# EAGLE design SN74HC165 Shift-In Breakout-v11 (EAGLE 6.2)
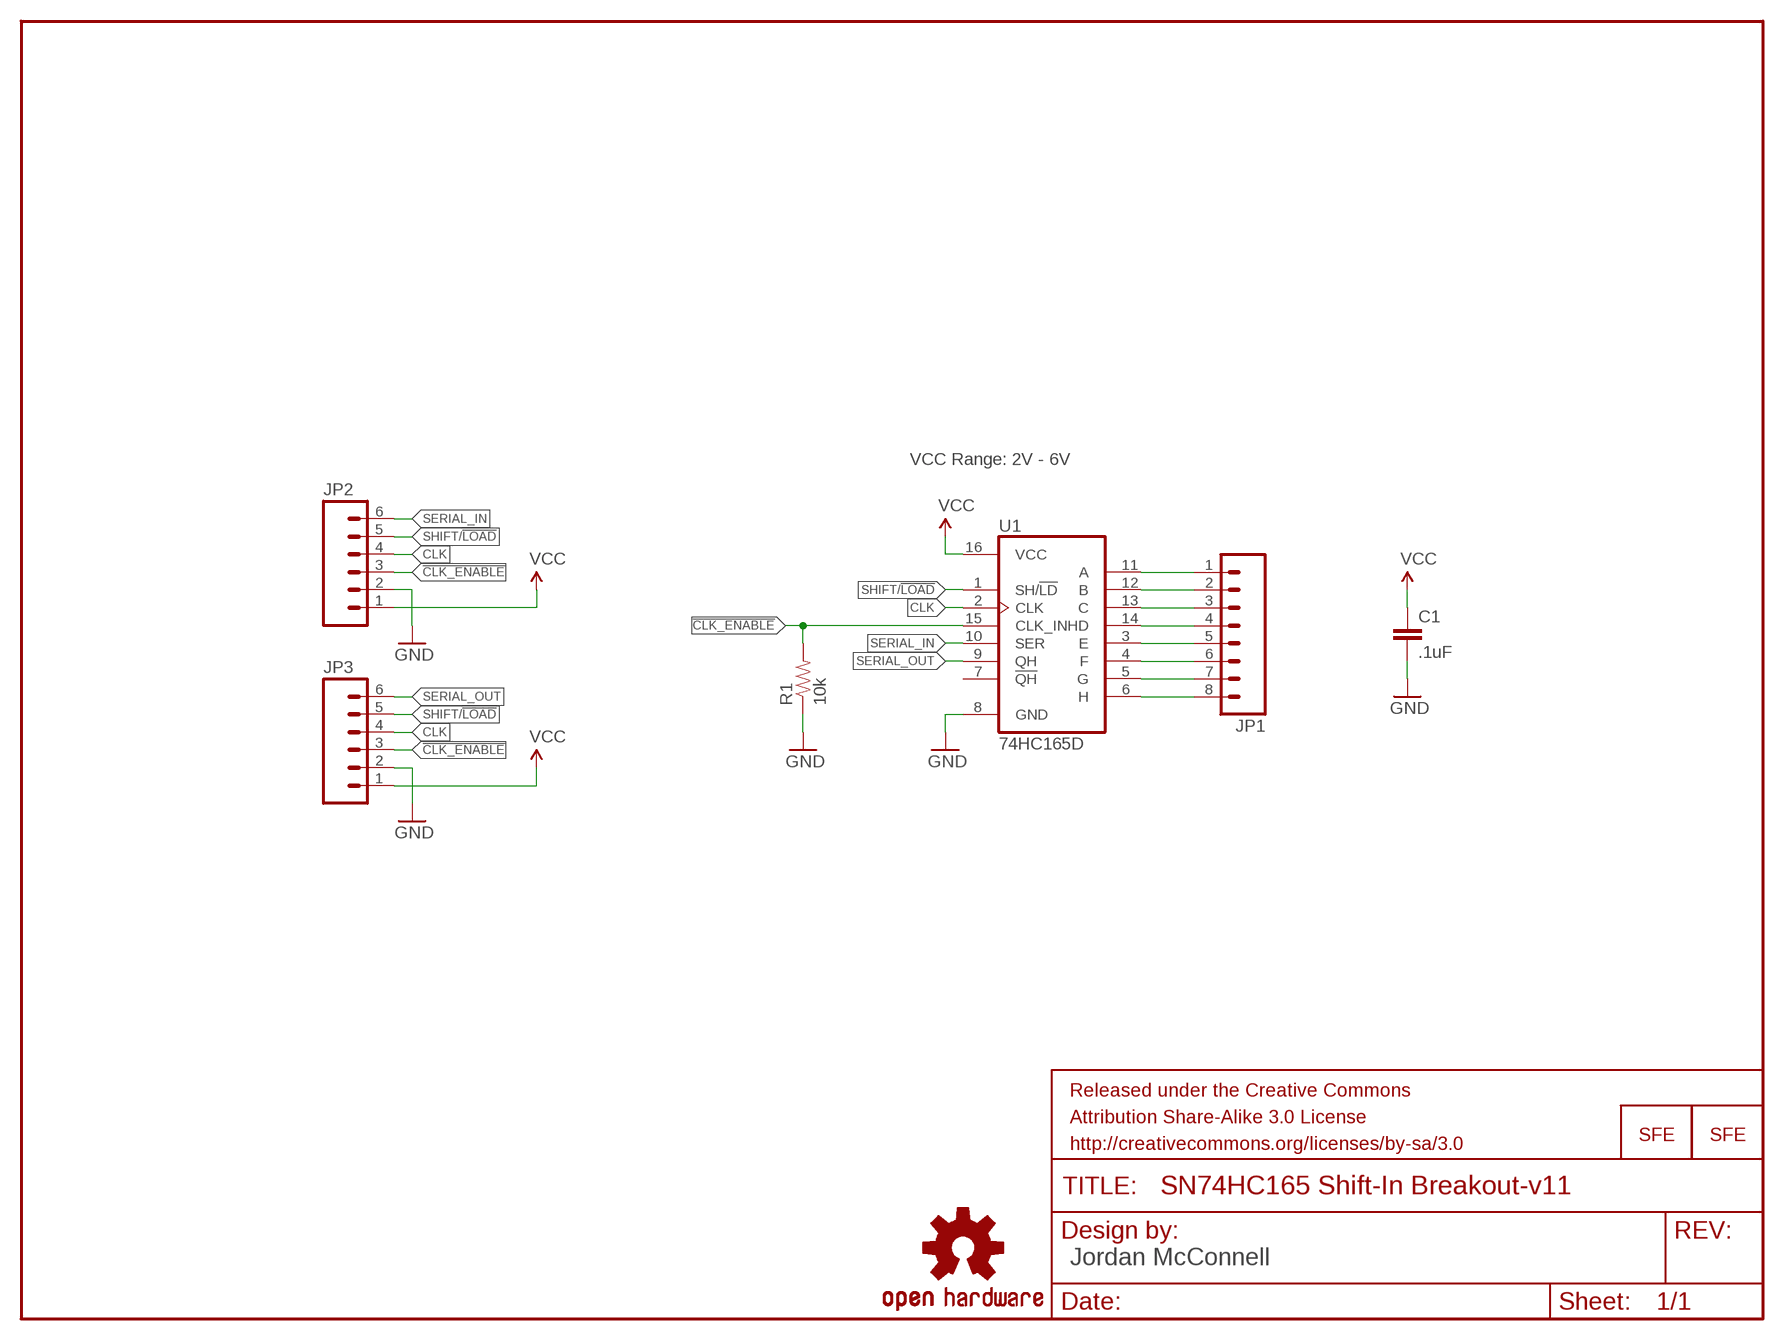
[diagram p0: schematic, sheet 1]

## Parts
C1  .1uF  CAP0402-CAP  [0402-CAP]
FRAME1  FRAME-LETTER  [CREATIVE_COMMONS]
JP1  M081X08  [1X08]
JP2  M06SIP  [1X06]
JP3  M06SIP  [1X06]
JP4  LOGO-SFESK  [SFE-LOGO-FLAME]
JP5  LOGO-SFENEW  [SFE-NEW-WEBLOGO]
R1  10k  RESISTOR0402-RES  [0402-RES]
U1  74HC165D  74165D  [SO16]
U$1  OSHW-LOGOS  [OSHW-LOGO-S]

## Nets
!CLK_ENABLE: JP2.3 JP3.3 R1.2 U1.15(CLK_INH)
A: JP1.1 U1.11(A)
B: JP1.2 U1.12(B)
C: JP1.3 U1.13(C)
CLK: JP2.4 JP3.4 U1.2(CLK)
D: JP1.4 U1.14(D)
E: JP1.5 U1.3(E)
F: JP1.6 U1.4(F)
G: JP1.7 U1.5(G)
GND: C1.2 JP2.2 JP3.2 R1.1 U1.8(GND)
H: JP1.8 U1.6(H)
SERIAL_IN: JP2.6 U1.10(SER)
SERIAL_OUT: JP3.6 U1.9(QH)
SHIFT/!LOAD: JP2.5 JP3.5 U1.1(SH/!LD)
VCC: C1.1 JP2.1 JP3.1 U1.16(VCC)
Unconnected: U1.7(!QH)

## Notes on the sheet
- VCC Range: 2V - 6V
- Jordan McConnell

## Library data of the parts
C1 = SparkFun-Passives:CAP: Capacitor Standard 0603 ceramic capacitor, and 0.1" leaded capacitor.
FRAME1 = SparkFun-Aesthetics:FRAME-LETTER: Schematic Frame Standard 8.5x11 US Letter frame
JP1 = SparkFun-Connectors:M08: Header 8 Standard 8-pin 0.1" header. Use with straight break away headers (SKU : PRT-00116), right angle break away headers (PRT-00553), swiss pins (PRT-00743), machine pins (PRT-00117), and female headers (PRT-00115).
JP2 JP3 = SparkFun-Connectors:M06: Header 6 Standard 6-pin 0.1" header. Use with straight break away headers (SKU : PRT-00116), right angle break away headers (PRT-00553), swiss pins (PRT-00743), machine pins (PRT-00117), and female headers (PRT-00115). Molex polarized connector foot print use with SKU : PRT-08094 with associated crimp pins and housings. NOTES ON THE VARIANTS LOCK and LOCK_LONGPADS... This footprint was designed to help hold the alignment of a through-hole component (i.e. 6-pin header) while soldering it into place. You may notice that each hole has been shifted either up or down by 0.005 of an inch from it's more standard position (which is a perfectly straight line). This slight alteration caused the pins (the squares in the middle) to touch the edges of the holes. Because they are alternating, it causes a "brace" to hold the component in place. 0.005 has proven to be the perfect amount of "off-center" position when using our standard breakaway headers. Although looks a little odd when you look at the bare footprint, once you have a header in there, the alteration is very hard to notice. Also, if you push a header all the way into place, it is covered up entirely on the bottom side. This idea of altering the position of holes to aid alignment will be further integrated into the Sparkfun Library for other footprints. It can help hold any component with 3 or more connection pins.
JP4 JP5 = SparkFun-Aesthetics:LOGO-SFE: Spark Fun Electronics PCB Logo This is the standard Spark Fun Electronics PCB logo.
R1 = SparkFun-Passives:RESISTOR: Resistor Basic schematic elements and footprints for 0603, 1206, and PTH resistors.
U1 = SparkFun-DigitalIC:74*165
U$1 = SparkFun-Aesthetics:OSHW-LOGO: Open Source Hardware Logo This logo indicates the piece of hardware it is found on incorporates a OSHW license and/or adheres to the definition of open source hardware found here: http://freedomdefined.org/OSHW

## Board
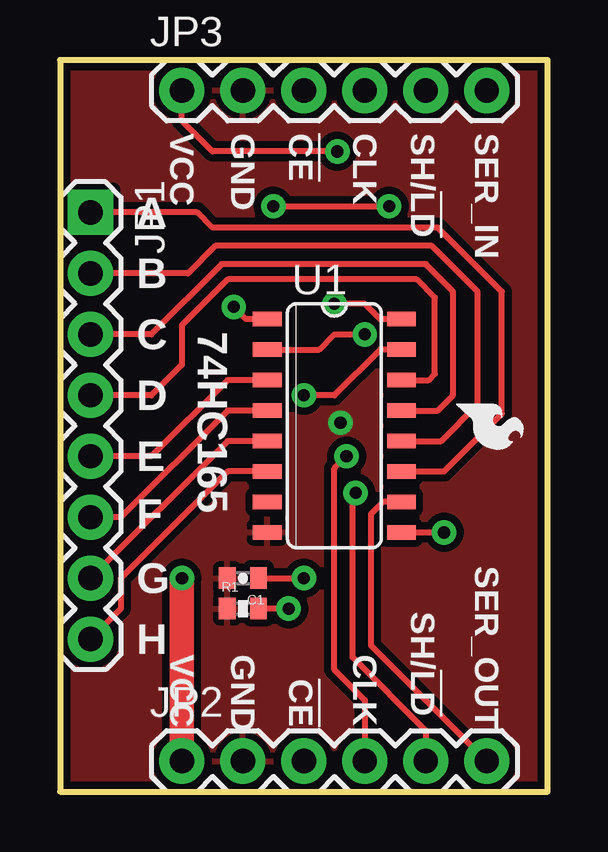
[diagram p1: board, top side]
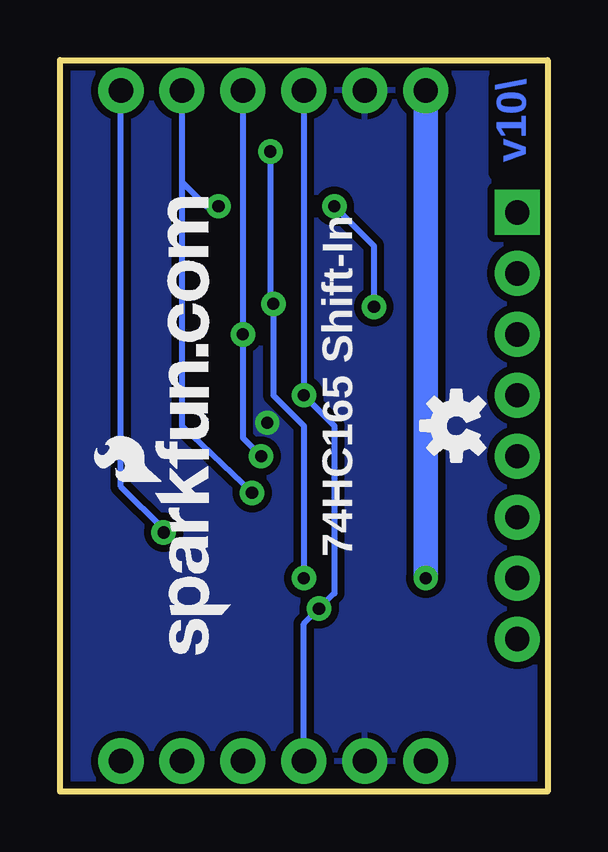
[diagram p2: board, bottom side, seen from below]

Size 20.32 x 30.48 mm. Coordinates in mm from the lower left corner, seen from the top.
Outline: 0,0 20.32,0 20.32,30.48 0,30.48 0,0
Copper layers (1*16): Top 0.035mm / dielectric 1.5mm / Bottom 0.035mm
Design rules: minimum track width 8mil, minimum drill 20mil, track to track 8mil, track to pad 8mil, pad to pad 8mil, via to via 8mil, smd to smd 8mil, copper to edge 8mil, drill to drill 8mil, minimum pad ring 12mil, minimum via ring 10mil, stop-mask expansion 4mil, vias tented up to drill 20mil, thermal gap 10mil

### Footprints (pad centres in the part's own frame; a part is rotated, then mirrored left to right if it is on the bottom)
0402-CAP = smd 0.7 x 0.9: 1 -0.65,0; 2 0.65,0
1X08 = drill 1.016 pad 1.88 square: 1 0,0 | drill 1.016 pad 1.88: 2 2.54,0; 3 5.08,0; 4 7.62,0; 5 10.16,0; 6 12.7,0; 7 15.24,0; 8 17.78,0
1X06 = drill 1.016 pad 1.88: 1 0,0; 2 2.54,0; 3 5.08,0; 4 7.62,0; 5 10.16,0; 6 12.7,0
0402-RES = smd 0.7 x 0.9: 1 -0.65,0; 2 0.65,0
SO16 = smd 0.6 x 1.2: 1 -4.445,-2.8; 2 -3.175,-2.8; 3 -1.905,-2.8; 4 -0.635,-2.8; 5 0.635,-2.8; 6 1.905,-2.8; 7 3.175,-2.8; 8 4.445,-2.8; 9 4.445,2.8; 10 3.175,2.8; 11 1.905,2.8; 12 0.635,2.8; 13 -0.635,2.8; 14 -1.905,2.8; 15 -3.175,2.8; 16 -4.445,2.8

### Placement (x,y rotation side)
C1  7.62,8.89 180 top
FRAME1  -11.43,-16.51 0 top  (outside the outline)
JP1  1.27,24.13 270 top
JP2  5.08,1.27 0 top
JP3  5.08,29.21 0 top
JP4  16.51,16.13 270 top
JP5  13.21,5.71 90 bottom
R1  7.62,7.62 0 top
U1  11.43,15.24 270 top
U$1  3.81,15.24 90 bottom

### Tracks (layer width: path | path; a pad name or v marks a point on that pad's centre or on a via)
!CLK_ENABLE  (via drill 0.51)
  Top 0.254: U1.15 13.34,18.41 11.43,16.51 v10.16,16.51 | v9.53,7.62 R1.2
  Bottom 0.254: JP3.3 v10.16,16.51 8.89,15.24 8.89,8.26 v9.53,7.62 10.16,6.99 JP2.3
A
  Top 0.254: U1.11 16,13.34 18.41,15.75 18.41,20.83 15.75,23.5 6.35,23.5 5.71,24.13 JP1.1
B
  Top 0.254: U1.12 15.88,14.61 17.4,16.13 17.4,20.83 15.49,22.73 6.48,22.73 5.33,21.59 JP1.2
C
  Top 0.254: U1.13 15.75,15.88 16.38,16.51 16.38,20.83 15.24,21.97 6.73,21.97 3.81,19.05 JP1.3
CLK  (via drill 0.51)
  Top 0.254: U1.2 10.79,18.41 11.43,19.05 v12.7,19.05 | JP2.4 12.7,3.81 11.43,5.08 11.43,13.46 v11.94,13.97
  Bottom 0.254: JP3.4 v12.7,19.05 12.7,14.73 v11.94,13.97
D
  Top 0.254: U1.14 15.37,17.14 15.62,17.4 15.62,20.57 14.86,21.34 6.99,21.34 5.08,19.43 5.08,17.78 3.81,16.51 JP1.4
E
  Top 0.254: U1.3 6.99,17.14 3.81,13.97 JP1.5
F
  Top 0.254: U1.4 6.99,15.88 2.54,11.43 JP1.6
G
  Top 0.254: U1.5 6.99,14.61 JP1.7
GND  (via drill 0.51)
  other vias: 11.68,15.37
  pour Bottom (isolate 0.305): 0,0 0,30.48 20.32,30.48 20.32,0
  pour Top (isolate 0.305): 0,0 0,30.48 20.32,30.48 20.32,0
H
  Top 0.254: U1.6 6.99,13.34 2.54,8.89 2.54,7.62 JP1.8
SERIAL_IN
  Top 0.254: U1.10 13.46,12.06 12.95,11.56 12.95,6.1 JP2.6
SERIAL_OUT  (via drill 0.51)
  Top 0.254: U1.9 v16,10.79
  Bottom 0.254: v16,10.79 16,10.92 17.78,12.7 JP3.6
SHIFT/!LOAD  (via drill 0.51)
  Top 0.254: U1.1 7.75,19.68 v7.24,20.19 | JP2.5 15.24,2.54 12.19,5.59 12.19,12.32 v12.32,12.45 | v8.89,24.38 v13.72,24.38
  Bottom 0.254: JP3.5 15.24,25.4 | 15.24,25.4 15.24,15.24 v12.32,12.45 | v8.89,24.38 7.24,22.73 v7.24,20.19 | 15.24,25.4 14.22,24.38 v13.72,24.38
VCC  (via drill 0.51)
  Top 0.254: U1.16 13.34,19.68 12.7,20.32 v11.43,20.32 | v11.56,26.67 6.35,26.67 5.08,27.94 JP3.1 | C1.1 v10.16,8.89
  Top 1.016: JP2.1 v5.08,8.89
  Bottom 0.254: v11.56,26.67 11.56,20.45 v11.43,20.32 11.43,16.51 10.16,15.24 v10.16,8.89
  Bottom 1.016: JP3.1 v5.08,8.89

### Text on the board
Bottom: v10\
tPlace: VCC | GND | !CE | CLK | SH/!LD | SER_IN | A | B | 74HC165 | C | D | E | F | SER_OUT | G | SH/!LD | H | VCC | GND | CLK | !CE
bPlace: 74HC165 Shift-In
Reference: Jordan McConnell